# Altium schematic sheet Power.SchDoc
size A4; SheetNumber: 6; SheetTotal: 10
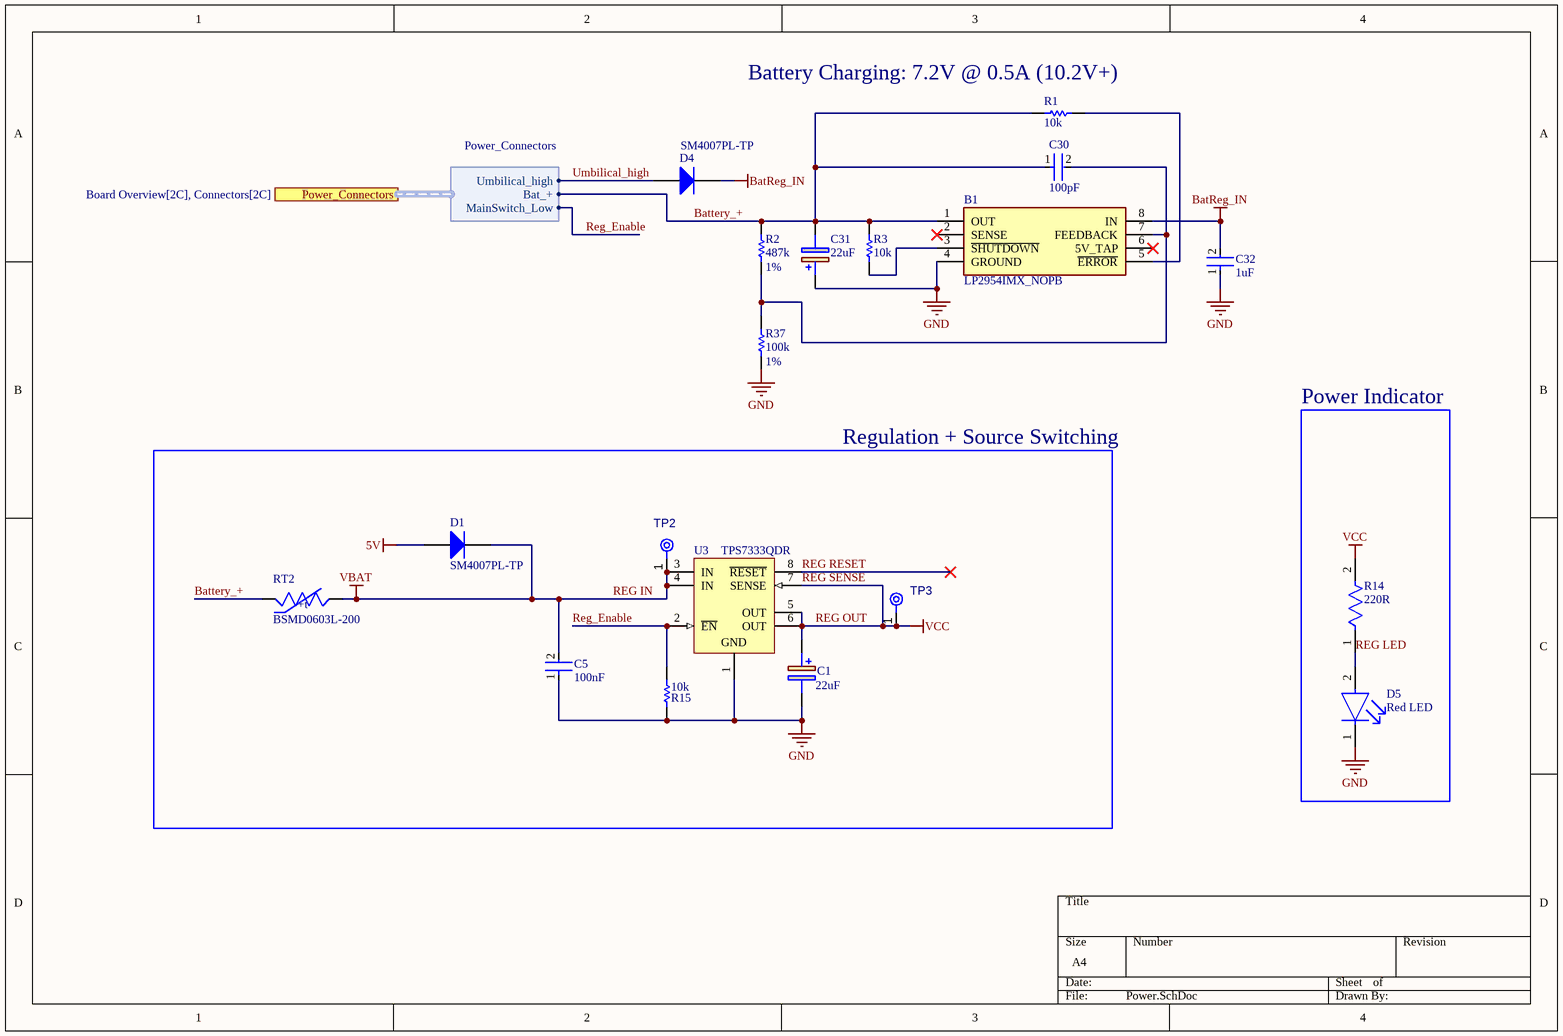
[diagram p0: Power.SchDoc]

## Parts
B1  LP2954IMX_NOPB  [SOIC127P600X175-8N]
C1  Capacitance: 22uF  [CAPPM3528X210N]  (hidden comment: TPSB226K010R0500)
C5  value 100nF  [FP-0603-L_1_6_0_15-W_0_81-IPC_C]  (hidden comment: Generic-Capacitor)
C30  value 100pF  [FP-0603-L_1_6_0_15-W_0_81-IPC_C]  (hidden comment: Generic-Capacitor)
C31  Capacitance: 22uF  [CAPPM3528X210N]  (hidden comment: TPSB226K010R0500)
C32  value 1uF  [FP-0603-L_1_6_0_15-W_0_81-IPC_C]  (hidden comment: Generic-Capacitor)
D1  SM4007PL-TP  [MCC-SOD-123FL_V]
D4  SM4007PL-TP  [MCC-SOD-123FL_V]
D5  Red LED  [FP-LTST-C190GKT-MFG]
R1  value 10k  [RESC1609X50X30ML8T20]  (hidden comment: Generic-Resistor)
R2  value 487k  Tolerance: 1%  [RESC1609X50X30ML8T20]  (hidden comment: Generic-Resistor)
R3  value 10k  [RESC1609X50X30ML8T20]  (hidden comment: Generic-Resistor)
R14  220R  [FP-CRCW0603-e3-IPC_C]
R15  10k  [RESC1608X55X25ML10T15]
R37  value 100k  Tolerance: 1%  [RESC1609X50X30ML8T20]  (hidden comment: Generic-Resistor)
RT2  BSMD0603L-200  [THRMC1608X95N]
TP2  TPAD6R  [TP06R]  (value not drawn)  (no BOM)
TP3  TPAD6R  [TP06R]  (value not drawn)  (no BOM)
U3  TPS7333QDR  [D0008A_L]

## Blocks framed on the sheet
Power Indicator: D5 R14
Regulation + Source Switching: C1 C5 D1 R15 RT2 TP2 TP3 U3

## Ports
Power_Connectors (harness Power_Connectors, see Board Overview[2C], Connectors[2C])

## Harnesses
Power_Connectors: Bat_+, MainSwitch_Low, Umbilical_high

## Nets
5V: D1.1(A)
BatReg_IN: B1.8(IN) C32.2 D4.2(K)
GND: B1.4(GROUND) C1.2(-) C5.1 C31.1(+) C32.1 D5.1(C) R15.1 R37.2 U3.1(GND)
REG IN: C5.2 D1.2(K) RT2.2 TP2.1(TP) U3.3(IN) U3.4(IN)  [also labelled VBAT]
REG OUT: C1.1(+) R14.2 TP3.1(TP) U3.5(OUT) U3.6(OUT) U3.7(SENSE)  [also labelled REG SENSE, VCC]
Battery_+: B1.1(OUT) C30.1 C31.2(-) R1.1 R2.1 R3.2 RT2.1 ; port Power_Connectors.Bat_+
REG LED: D5.2(A) R14.1
REG RESET: U3.8(~{RESET})
Reg_Enable: R15.2 U3.2(~{EN}) ; port Power_Connectors.MainSwitch_Low
Umbilical_high: D4.1(A) ; port Power_Connectors.Umbilical_high
NetB1_3: B1.3(~{SHUTDOWN}) R3.1
NetB1_5: B1.5(~{ERROR}) R1.2
NetB1_7: B1.7(FEEDBACK) C30.2 R2.2 R37.1

Not connected (* = marked no-connect by the designer): B1 2(SENSE)* 6(5V_TAP)*

## Notes on the sheet
- (near R1) Battery Charging: 7.2V @ 0.5A (10.2V+)
- (in symbol CMP-038-000000-2) +t

## Library data of the parts
B1 = CMP-086-000000-1: 5V and Adjustable Micropower LDOs; Manufacturer_Part_Number: LP2954IMX/NOPB; Manufacturer_Name: Texas Instruments; Geometry.Height: 1.75mm; Mouser Part Number: 926-LP2954IMX/NOPB; Mouser Price/Stock: https://www.mouser.co.uk/ProductDetail/Texas-Instruments/LP2954IMX-NOPB?qs=7lkVKPoqpbZZvpkFdRlvsg%3D%3D; Design Item ID: LP2954IMX_NOPB; Datasheet Link: http://www.ti.com/lit/gpn/LP2954; Source: LP2954IMX_NOPB.SchLib; LCSC Part #: C7989
C1 C31 = CMP-054-000000-2: AVX Electrolytic Capacitor 22uF 10V dc Electrolytic Solid +/-10% Tolerance TPS Series; Geometry.Height: 2.1mm; Manufacturer_Name: AVX; Manufacturer_Part_Number: TPSB226K010R0500; LCSC Part #: C400102; Mouser Part Number: 581-TPSB226K010R0500; Source: TPSB226K010R0500.SchLib; Design Item ID: TPSB226K010R0500; Datasheet Link: https://componentsearchengine.com/Datasheets/1/TPSB226K010R0500.pdf; Mouser Price/Stock: https://www.mouser.com/Search/Refine.aspx?Keyword=581-TPSB226K010R0500
C5 C30 C32 = CMP-001-00088-6: Generic 0603 Capacitor; Dielectric: X7R; Voltage Rating: 50V; Tolerance: 10%; ESR: 0R; Case Code (Imperial): 0603
  C5: LCSC Part #: C14663
  C30: LCSC Part #: C14858
  C32: LCSC Part #: C15849
D1 D4 = CMP-004-00034-1: DIODE GEN PURP 1KV 1A SOD123FL; LCSC Part #: C64898
D5 = CMP-00026-00001-1: SZYY0603R; LCSC PART #: C434419
R1 R3 = CMP-009-00185-4: Generic 0603 Resistor; Power Rating: 100mW; Voltage Rating: 75V; Tolerance: 0%; Case Code (Metric): 1608; Case Code (Imperial): 0603; LCSC Part #: C25804
R2 R37 = CMP-009-00185-4: Generic 0603 Resistor; Power Rating: 100mW; Voltage Rating: 75V; Case Code (Metric): 1608; Case Code (Imperial): 0603
  R2: LCSC Part #: C2930107
  R37: LCSC Part #: C25803
R14 = 0603WAF220JT5E-2: Res Thick Film 0603 220 Ohm 1% 1/10W ±100ppm/°C Molded SMD SMD Paper T/R; Power Rating: 100mW; Voltage Rating: 75V; Resistance: 220R; Resistance Tolerance: 1%; LCSC Part #: C22962
R15 = CMP-009-00177-3: ±1% 1/10W Thick Film Resistors 75V ±100ppm/℃ -55℃~+155℃ 10kΩ 0603 Chip Resistor - Surface Mount ROHS; LCSC Part #: C25804; Value: 10k
RT2 = CMP-038-000000-2: PTC Resettable Fuse: 2A Hold, 4A Trip, 0603; Hold Current: 2A; Pin Count: 2; Component Type: Standard; Availability: Unavailable; MP: BSMD0603L-200; Package: 0603; Design Item ID: BSMD0603L-200; Trip Current: 4A; LCSC Part #: C2757930
TP2 TP3 = CMP-00028-00002-2: 0.6mm round; Pins: 1
U3 = CMP-019-00052-1: IC REG LDO 3.3V 0.5A 8SOIC; LCSC Part #: C23791